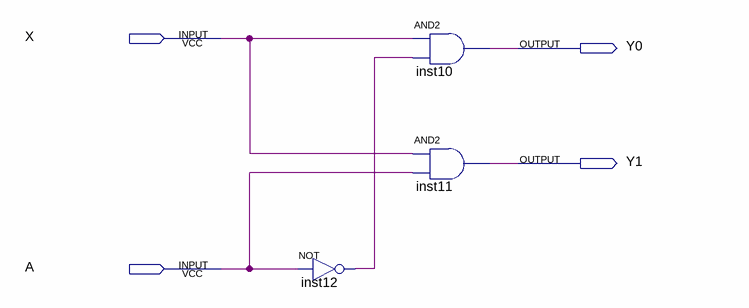
[diagram p0: schematic sheet]
// Quartus schematic demux2.bdf as structural Verilog: 3 symbols, 4 pins
module demux2 (
  input  X,
  input  A,
  output Y0,
  output Y1
);

  wire inst12_out;

  not inst12 (inst12_out, A);
  and inst10 (Y0, X, inst12_out);
  and inst11 (Y1, X, A);
endmodule
